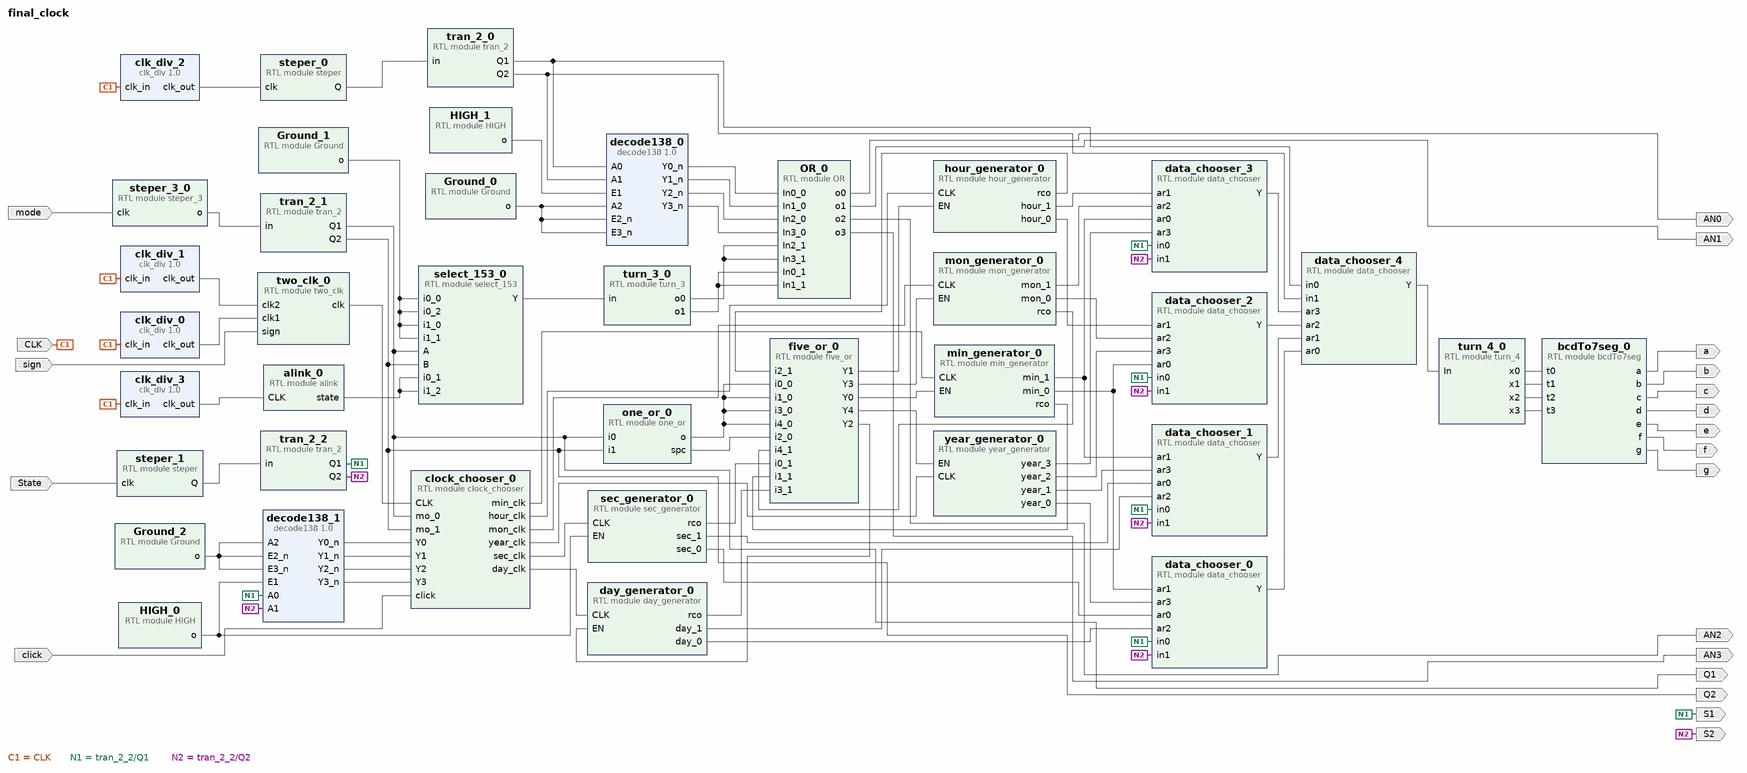
[diagram p0: block diagram of the top level]
# Vivado block design final_clock, xc7a35tcpg236-1, Vivado 2017.2
create_bd_design final_clock

create_bd_port -dir I sign
create_bd_port -dir I -type clk CLK
create_bd_port -dir O a
create_bd_port -dir O b
create_bd_port -dir O c
create_bd_port -dir O d
create_bd_port -dir O e
create_bd_port -dir O f
create_bd_port -dir O g
create_bd_port -dir O AN0
create_bd_port -dir O AN1
create_bd_port -dir O AN2
create_bd_port -dir O AN3
create_bd_port -dir I -type clk mode
create_bd_port -dir I State
create_bd_port -dir O S1
create_bd_port -dir O S2
create_bd_port -dir O Q1
create_bd_port -dir O Q2
create_bd_port -dir I click

create_bd_cell -type ip -vlnv xilinx.com:xup:clk_div:1.0 clk_div_0
set_property -dict {CONFIG.N 10000} [get_bd_cells clk_div_0]
create_bd_cell -type ip -vlnv xilinx.com:xup:clk_div:1.0 clk_div_1
create_bd_cell -type ip -vlnv xilinx.com:XUP:decode138:1.0 decode138_0
create_bd_cell -type ip -vlnv xilinx.com:xup:clk_div:1.0 clk_div_2
set_property -dict {CONFIG.N 10000} [get_bd_cells clk_div_2]
create_bd_cell -type ip -vlnv xilinx.com:xup:clk_div:1.0 clk_div_3
set_property -dict {CONFIG.N 20000000} [get_bd_cells clk_div_3]
create_bd_cell -type ip -vlnv xilinx.com:XUP:decode138:1.0 decode138_1
create_bd_cell -type module -reference Ground Ground_0
create_bd_cell -type module -reference Ground Ground_1
create_bd_cell -type module -reference Ground Ground_2
create_bd_cell -type module -reference HIGH HIGH_0
create_bd_cell -type module -reference HIGH HIGH_1
create_bd_cell -type module -reference OR OR_0
create_bd_cell -type module -reference alink alink_0
create_bd_cell -type module -reference bcdTo7seg bcdTo7seg_0
create_bd_cell -type module -reference clock_chooser clock_chooser_0
create_bd_cell -type module -reference data_chooser data_chooser_0
create_bd_cell -type module -reference data_chooser data_chooser_1
create_bd_cell -type module -reference data_chooser data_chooser_2
create_bd_cell -type module -reference data_chooser data_chooser_3
create_bd_cell -type module -reference data_chooser data_chooser_4
create_bd_cell -type module -reference day_generator day_generator_0
create_bd_cell -type module -reference five_or five_or_0
create_bd_cell -type module -reference hour_generator hour_generator_0
create_bd_cell -type module -reference min_generator min_generator_0
create_bd_cell -type module -reference mon_generator mon_generator_0
create_bd_cell -type module -reference one_or one_or_0
create_bd_cell -type module -reference sec_generator sec_generator_0
create_bd_cell -type module -reference select_153 select_153_0
create_bd_cell -type module -reference steper steper_0
create_bd_cell -type module -reference steper steper_1
create_bd_cell -type module -reference steper_3 steper_3_0
create_bd_cell -type module -reference tran_2 tran_2_0
create_bd_cell -type module -reference tran_2 tran_2_1
create_bd_cell -type module -reference tran_2 tran_2_2
create_bd_cell -type module -reference turn_3 turn_3_0
create_bd_cell -type module -reference turn_4 turn_4_0
create_bd_cell -type module -reference two_clk two_clk_0
create_bd_cell -type module -reference year_generator year_generator_0

# ---- connections ----

connect_bd_net [get_bd_ports sign] [get_bd_pins two_clk_0/sign]
connect_bd_net [get_bd_ports CLK] \
  [get_bd_pins clk_div_0/clk_in] [get_bd_pins clk_div_1/clk_in] [get_bd_pins clk_div_2/clk_in] [get_bd_pins clk_div_3/clk_in]
connect_bd_net [get_bd_pins clk_div_1/clk_out] [get_bd_pins two_clk_0/clk2]
connect_bd_net [get_bd_pins clk_div_0/clk_out] [get_bd_pins two_clk_0/clk1]
connect_bd_net [get_bd_pins HIGH_0/o] [get_bd_pins decode138_1/E1] [get_bd_pins sec_generator_0/EN]
connect_bd_net [get_bd_pins bcdTo7seg_0/a] [get_bd_ports a]
connect_bd_net [get_bd_pins bcdTo7seg_0/b] [get_bd_ports b]
connect_bd_net [get_bd_pins bcdTo7seg_0/c] [get_bd_ports c]
connect_bd_net [get_bd_pins bcdTo7seg_0/d] [get_bd_ports d]
connect_bd_net [get_bd_pins bcdTo7seg_0/e] [get_bd_ports e]
connect_bd_net [get_bd_pins bcdTo7seg_0/f] [get_bd_ports f]
connect_bd_net [get_bd_pins bcdTo7seg_0/g] [get_bd_ports g]
connect_bd_net [get_bd_pins clk_div_2/clk_out] [get_bd_pins steper_0/clk]
connect_bd_net [get_bd_pins steper_0/Q] [get_bd_pins tran_2_0/in]
connect_bd_net [get_bd_pins tran_2_0/Q1] [get_bd_pins decode138_0/A0] [get_bd_pins data_chooser_4/in0]
connect_bd_net [get_bd_pins tran_2_0/Q2] [get_bd_pins decode138_0/A1] [get_bd_pins data_chooser_4/in1]
connect_bd_net [get_bd_pins HIGH_1/o] [get_bd_pins decode138_0/E1]
connect_bd_net [get_bd_pins Ground_0/o] [get_bd_pins decode138_0/A2] [get_bd_pins decode138_0/E2_n] [get_bd_pins decode138_0/E3_n]
connect_bd_net [get_bd_pins OR_0/o0] [get_bd_ports AN0]
connect_bd_net [get_bd_pins OR_0/o1] [get_bd_ports AN1]
connect_bd_net [get_bd_pins OR_0/o2] [get_bd_ports AN2]
connect_bd_net [get_bd_pins OR_0/o3] [get_bd_ports AN3]
connect_bd_net [get_bd_pins steper_3_0/o] [get_bd_pins tran_2_1/in]
connect_bd_net [get_bd_ports mode] [get_bd_pins steper_3_0/clk]
connect_bd_net [get_bd_pins decode138_0/Y0_n] [get_bd_pins OR_0/In0_0]
connect_bd_net [get_bd_pins decode138_0/Y1_n] [get_bd_pins OR_0/In1_0]
connect_bd_net [get_bd_pins decode138_0/Y2_n] [get_bd_pins OR_0/In2_0]
connect_bd_net [get_bd_pins decode138_0/Y3_n] [get_bd_pins OR_0/In3_0]
connect_bd_net [get_bd_pins select_153_0/Y] [get_bd_pins turn_3_0/in]
connect_bd_net [get_bd_pins Ground_1/o] \
  [get_bd_pins select_153_0/i0_0] [get_bd_pins select_153_0/i0_2] [get_bd_pins select_153_0/i1_0] \
  [get_bd_pins select_153_0/i1_1]
connect_bd_net [get_bd_ports State] [get_bd_pins steper_1/clk]
connect_bd_net [get_bd_pins steper_1/Q] [get_bd_pins tran_2_2/in]
connect_bd_net [get_bd_pins sec_generator_0/sec_0] [get_bd_pins data_chooser_0/ar0]
connect_bd_net [get_bd_pins sec_generator_0/sec_1] [get_bd_pins data_chooser_1/ar0]
connect_bd_net [get_bd_pins min_generator_0/min_0] [get_bd_pins data_chooser_0/ar1] [get_bd_pins data_chooser_2/ar0]
connect_bd_net [get_bd_pins min_generator_0/min_1] [get_bd_pins data_chooser_1/ar1] [get_bd_pins data_chooser_3/ar0]
connect_bd_net [get_bd_pins hour_generator_0/hour_0] [get_bd_pins data_chooser_2/ar1]
connect_bd_net [get_bd_pins hour_generator_0/hour_1] [get_bd_pins data_chooser_3/ar1]
connect_bd_net [get_bd_pins day_generator_0/day_0] [get_bd_pins data_chooser_0/ar2]
connect_bd_net [get_bd_pins day_generator_0/day_1] [get_bd_pins data_chooser_1/ar2]
connect_bd_net [get_bd_pins mon_generator_0/mon_0] [get_bd_pins data_chooser_2/ar2]
connect_bd_net [get_bd_pins mon_generator_0/mon_1] [get_bd_pins data_chooser_3/ar2]
connect_bd_net [get_bd_pins year_generator_0/year_0] [get_bd_pins data_chooser_0/ar3]
connect_bd_net [get_bd_pins year_generator_0/year_1] [get_bd_pins data_chooser_1/ar3]
connect_bd_net [get_bd_pins year_generator_0/year_2] [get_bd_pins data_chooser_2/ar3]
connect_bd_net [get_bd_pins year_generator_0/year_3] [get_bd_pins data_chooser_3/ar3]
connect_bd_net [get_bd_pins data_chooser_4/Y] [get_bd_pins turn_4_0/In]
connect_bd_net [get_bd_pins turn_4_0/x0] [get_bd_pins bcdTo7seg_0/t0]
connect_bd_net [get_bd_pins turn_4_0/x1] [get_bd_pins bcdTo7seg_0/t1]
connect_bd_net [get_bd_pins turn_4_0/x2] [get_bd_pins bcdTo7seg_0/t2]
connect_bd_net [get_bd_pins turn_4_0/x3] [get_bd_pins bcdTo7seg_0/t3]
connect_bd_net [get_bd_pins data_chooser_0/Y] [get_bd_pins data_chooser_4/ar0]
connect_bd_net [get_bd_pins data_chooser_1/Y] [get_bd_pins data_chooser_4/ar1]
connect_bd_net [get_bd_pins data_chooser_2/Y] [get_bd_pins data_chooser_4/ar2]
connect_bd_net [get_bd_pins data_chooser_3/Y] [get_bd_pins data_chooser_4/ar3]
connect_bd_net [get_bd_pins tran_2_2/Q1] \
  [get_bd_ports S1] [get_bd_pins decode138_1/A0] [get_bd_pins data_chooser_0/in0] [get_bd_pins data_chooser_1/in0] \
  [get_bd_pins data_chooser_2/in0] [get_bd_pins data_chooser_3/in0]
connect_bd_net [get_bd_pins tran_2_2/Q2] \
  [get_bd_ports S2] [get_bd_pins decode138_1/A1] [get_bd_pins data_chooser_0/in1] [get_bd_pins data_chooser_1/in1] \
  [get_bd_pins data_chooser_2/in1] [get_bd_pins data_chooser_3/in1]
connect_bd_net [get_bd_pins tran_2_1/Q1] [get_bd_ports Q1] [get_bd_pins clock_chooser_0/mo_0] [get_bd_pins one_or_0/i0] [get_bd_pins select_153_0/A]
connect_bd_net [get_bd_pins tran_2_1/Q2] [get_bd_ports Q2] [get_bd_pins clock_chooser_0/mo_1] [get_bd_pins one_or_0/i1] [get_bd_pins select_153_0/B]
connect_bd_net [get_bd_pins sec_generator_0/rco] [get_bd_pins five_or_0/i0_1]
connect_bd_net [get_bd_pins min_generator_0/rco] [get_bd_pins five_or_0/i1_1]
connect_bd_net [get_bd_pins hour_generator_0/rco] [get_bd_pins five_or_0/i2_1]
connect_bd_net [get_bd_pins day_generator_0/rco] [get_bd_pins five_or_0/i3_1]
connect_bd_net [get_bd_pins mon_generator_0/rco] [get_bd_pins five_or_0/i4_1]
connect_bd_net [get_bd_pins five_or_0/Y0] [get_bd_pins min_generator_0/EN]
connect_bd_net [get_bd_pins five_or_0/Y1] [get_bd_pins hour_generator_0/EN]
connect_bd_net [get_bd_pins five_or_0/Y2] [get_bd_pins day_generator_0/EN]
connect_bd_net [get_bd_pins five_or_0/Y3] [get_bd_pins mon_generator_0/EN]
connect_bd_net [get_bd_pins five_or_0/Y4] [get_bd_pins year_generator_0/EN]
connect_bd_net [get_bd_pins Ground_2/o] [get_bd_pins decode138_1/E2_n] [get_bd_pins decode138_1/E3_n] [get_bd_pins decode138_1/A2]
connect_bd_net [get_bd_pins two_clk_0/clk] [get_bd_pins clock_chooser_0/CLK]
connect_bd_net [get_bd_ports click] [get_bd_pins clock_chooser_0/click]
connect_bd_net [get_bd_pins decode138_1/Y0_n] [get_bd_pins clock_chooser_0/Y0]
connect_bd_net [get_bd_pins decode138_1/Y1_n] [get_bd_pins clock_chooser_0/Y1]
connect_bd_net [get_bd_pins decode138_1/Y2_n] [get_bd_pins clock_chooser_0/Y2]
connect_bd_net [get_bd_pins decode138_1/Y3_n] [get_bd_pins clock_chooser_0/Y3]
connect_bd_net [get_bd_pins clock_chooser_0/sec_clk] [get_bd_pins sec_generator_0/CLK]
connect_bd_net [get_bd_pins clock_chooser_0/min_clk] [get_bd_pins min_generator_0/CLK]
connect_bd_net [get_bd_pins clock_chooser_0/hour_clk] [get_bd_pins hour_generator_0/CLK]
connect_bd_net [get_bd_pins clock_chooser_0/day_clk] [get_bd_pins day_generator_0/CLK]
connect_bd_net [get_bd_pins clock_chooser_0/mon_clk] [get_bd_pins mon_generator_0/CLK]
connect_bd_net [get_bd_pins clock_chooser_0/year_clk] [get_bd_pins year_generator_0/CLK]
connect_bd_net [get_bd_pins clk_div_3/clk_out] [get_bd_pins alink_0/CLK]
connect_bd_net [get_bd_pins alink_0/state] [get_bd_pins select_153_0/i0_1] [get_bd_pins select_153_0/i1_2]
connect_bd_net [get_bd_pins turn_3_0/o0] [get_bd_pins OR_0/In2_1] [get_bd_pins OR_0/In3_1]
connect_bd_net [get_bd_pins turn_3_0/o1] [get_bd_pins OR_0/In0_1] [get_bd_pins OR_0/In1_1]
connect_bd_net [get_bd_pins one_or_0/o] \
  [get_bd_pins five_or_0/i0_0] [get_bd_pins five_or_0/i1_0] [get_bd_pins five_or_0/i3_0] [get_bd_pins five_or_0/i4_0]
connect_bd_net [get_bd_pins one_or_0/spc] [get_bd_pins five_or_0/i2_0]

validate_bd_design
save_bd_design
